# EAGLE design main_for_huzzah_wLED (EAGLE 7.3.0)
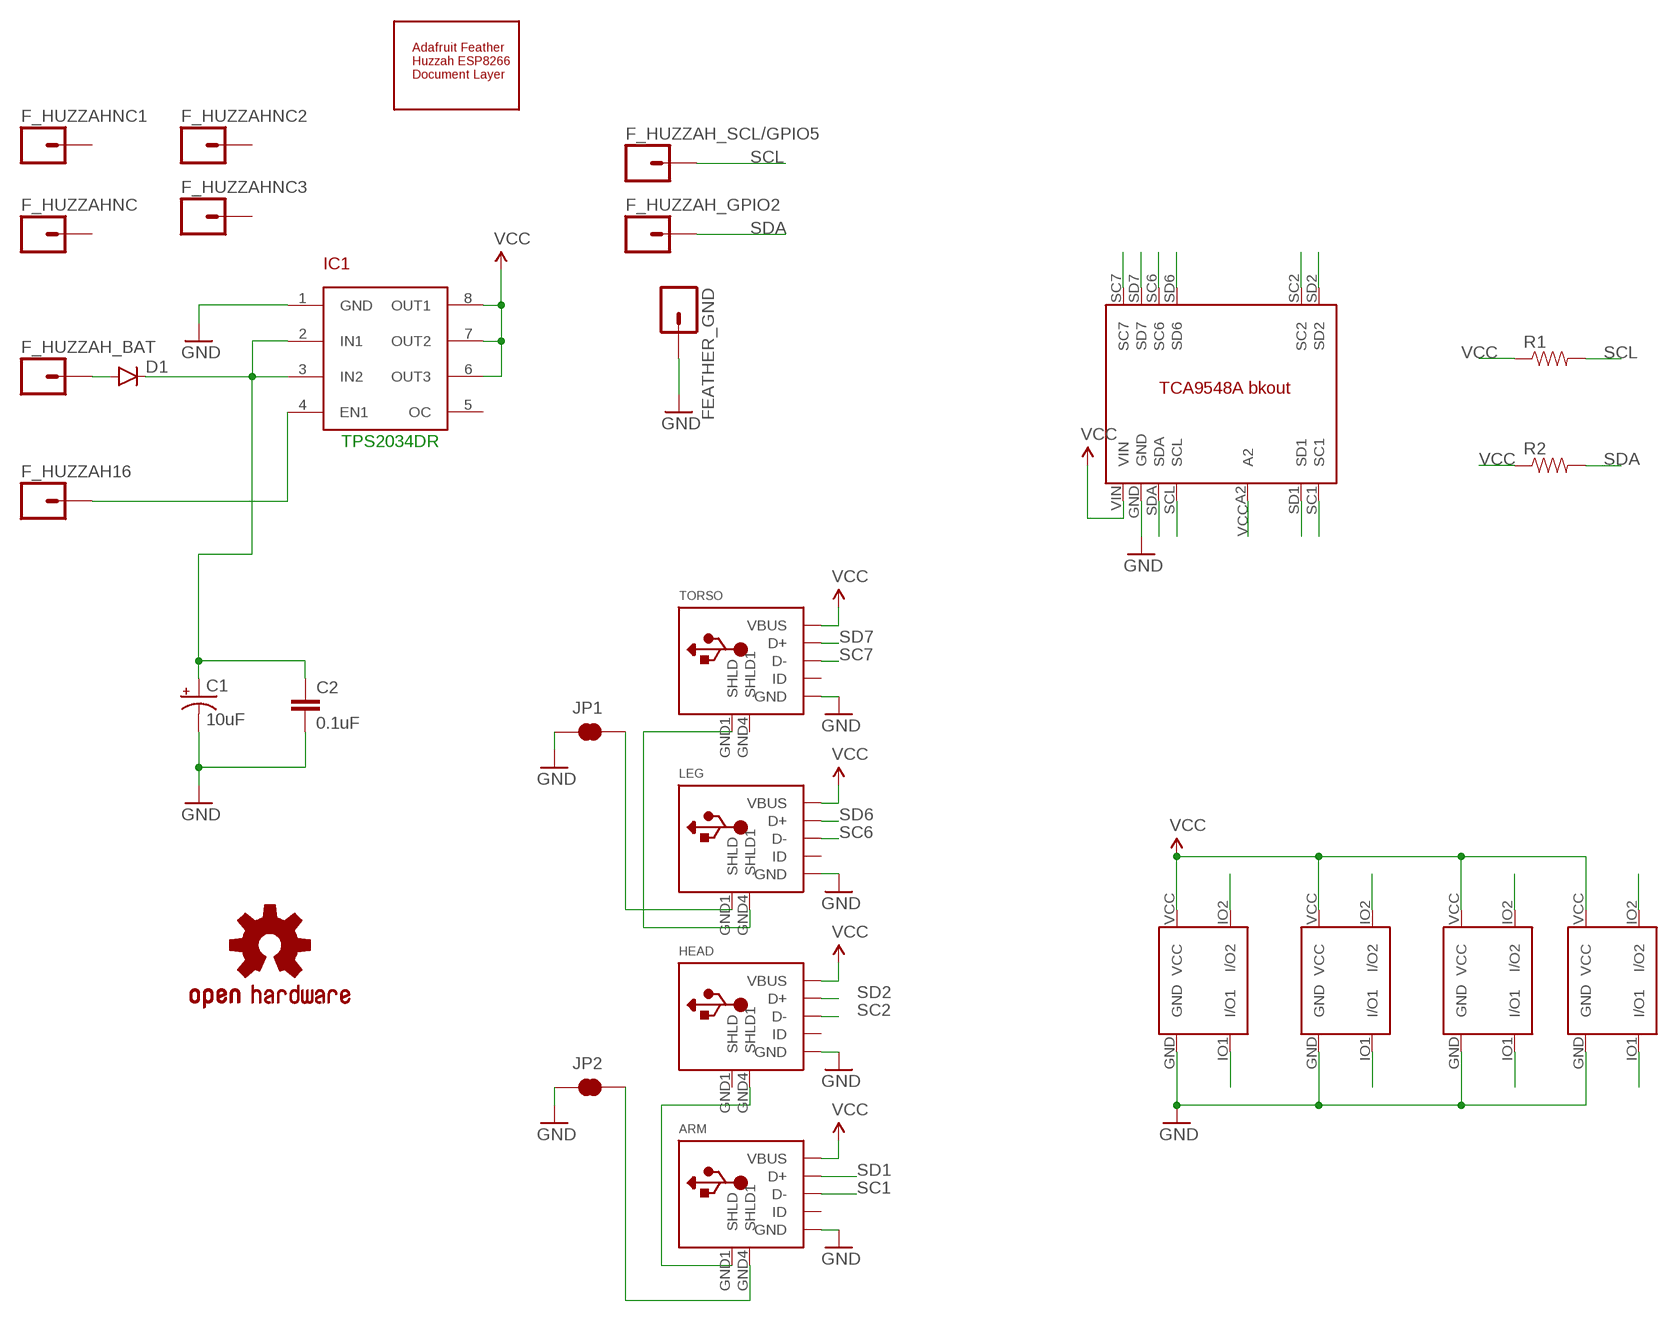
[diagram p0: schematic, sheet 1]

## Parts
ARM  USB  [USB-MINIB-THM-MOLEX_NOSLK]
C1  10uF  CAP_POLPTH2  [CPOL-RADIAL-10UF-25V]
C2  0.1uF  CAPPTH  [CAP-PTH-SMALL]
D1  DIODEKIT2  [DIODE-1N4001-KIT]
F_HUZZAH16  M01  [1X01SMALL_NS]
F_HUZZAH_BAT  M01  [1X01SMALL_NS]
F_HUZZAH_GPIO2  M01  [1X01SMALL_NS]
F_HUZZAH_SCL/GPIO5  M01  [1X01SMALL_NS]
F_HUZZAHNC  M01  [1X01SMALL_NS]
F_HUZZAHNC1  M01  [1X01SMALL_NS]
F_HUZZAHNC2  M01  [1X01SMALL_NS]
F_HUZZAHNC3  M01  [1X01SMALL_NS]
FEATHER_GND  M01  [1X01SMALL_NS]
HEAD  USB  [USB-MINIB-THM-MOLEX_NOSLK]
IC1  TPS2055A  [SO-08]
JP1  JUMPER-PAD-2-NC_BY_TRACENO_SILK  [PAD-JUMPER-2-NC_BY_TRACE_NO_SILK]
JP2  JUMPER-PAD-2-NC_BY_TRACENO_SILK  [PAD-JUMPER-2-NC_BY_TRACE_NO_SILK]
LEG  USB  [USB-MINIB-THM-MOLEX_NOSLK]
LOGO1  OSHW-LOGOM  [OSHW-LOGO-M]
R1  RESISTORAXIAL-0.3  [AXIAL-0.3]
R2  RESISTORAXIAL-0.3  [AXIAL-0.3]
TORSO  USB  [USB-MINIB-THM-MOLEX_NOSLK]
U$1  TCA9548_MIN  [TCA9548_NOEXTRA]
U$2  TVS_ARRAY_CD143A  [SOT-143]
U$3  TVS_ARRAY_CD143A  [SOT-143]
U$4  TVS_ARRAY_CD143A  [SOT-143]
U$5  TVS_ARRAY_CD143A  [SOT-143]
U$7  FEATHER_HUZZAH_DOCUMENT  [FEATHER_HUZZAH_DOC_ONLY]

## Nets
GND: ARM.GND C1.2(-) C2.2 FEATHER_GND.P$1 HEAD.GND IC1.1(GND) JP1.1 JP2.1 LEG.GND TORSO.GND U$1.GND U$2.GND U$3.GND U$4.GND U$5.GND
N$1: LEG.GND4(SHLD1) TORSO.GND1(SHLD)
N$2: JP1.2 LEG.GND1(SHLD)
N$3: ARM.GND1(SHLD) HEAD.GND4(SHLD1)
N$4: ARM.GND4(SHLD1) JP2.2
N$6: D1.A F_HUZZAH_BAT.P$1
N$7: F_HUZZAH16.P$1 IC1.4(EN1)
N$8: C1.1(+) C2.1 D1.C IC1.2(IN1) IC1.3(IN2)
SC1: ARM.D- U$1.SC1 U$3.IO1(I/O1)
SC2: HEAD.D- U$1.SC2 U$2.IO1(I/O1)
SC6: LEG.D- U$1.SC6 U$5.IO1(I/O1)
SC7: TORSO.D- U$1.SC7 U$4.IO1(I/O1)
SCL: F_HUZZAH_SCL/GPIO5.P$1 R1.P$2 U$1.SCL
SD1: ARM.D+ U$1.SD1 U$3.IO2(I/O2)
SD2: HEAD.D+ U$1.SD2 U$2.IO2(I/O2)
SD6: LEG.D+ U$1.SD6 U$5.IO2(I/O2)
SD7: TORSO.D+ U$1.SD7 U$4.IO2(I/O2)
SDA: F_HUZZAH_GPIO2.P$1 R2.P$2 U$1.SDA
VCC: ARM.VBUS HEAD.VBUS IC1.6(OUT3) IC1.7(OUT2) IC1.8(OUT1) LEG.VBUS R1.P$1 R2.P$1 TORSO.VBUS U$1.A2 U$1.VIN U$2.VCC U$3.VCC U$4.VCC U$5.VCC
Unconnected: ARM.ID F_HUZZAHNC1.P$1 F_HUZZAHNC2.P$1 F_HUZZAHNC3.P$1 F_HUZZAHNC.P$1 HEAD.GND1(SHLD) HEAD.ID IC1.5(OC) LEG.ID TORSO.GND4(SHLD1) TORSO.ID

## Notes on the sheet
- TPS2034DR

## Library data of the parts
ARM HEAD LEG TORSO = adafruit:USB: USB Connectors USBMINIB - Surface Mount Female Mini-B USB Connector 4UConnector: 06564 By microbuilder.eu Thru-hole RA Female Mini-B USB Connector 4UConnector: 18732 By ladyada.net
C1 = SparkFun-Passives:CAP_POL: Capacitor Polarized These are standard SMD and PTH capacitors. Normally 10uF, 47uF, and 100uF in electrolytic and tantalum varieties. Always verify the external diameter of the through hole cap, it varies with capacity, voltage, and manufacturer. The EIA devices should be standard.
C2 = SparkFun-Passives:CAP: Capacitor Standard 0603 ceramic capacitor, and 0.1" leaded capacitor.
D1 = SparkFun-DiscreteSemi:DIODE: Diode These are standard reverse protection diodes and small signal diodes. SMA package can handle up to about 1A. SOD-323 can handle about 200mA. What the SOD-323 package when ordering, there are some mfgs out there that are 5-pin packages.
F_HUZZAH16 F_HUZZAH_BAT F_HUZZAH_GPIO2 F_HUZZAH_SCL/GPIO5 F_HUZZAHNC F_HUZZAHNC1-F_HUZZAHNC3 FEATHER_GND = SparkFun-Connectors:M01: Header 1 Standard 1-pin 0.1" header. Use with straight break away headers (SKU : PRT-00116), right angle break away headers (PRT-00553), swiss pins (PRT-00743), machine pins (PRT-00117), and female headers (PRT-00115). SMTSO-256-ET is a "flush mount" nut for a 4-40 screw. The older package used to be too tight, and did not allow it to sit properly thru the drill hit. The latest (0.165DIA) fits nice and snug.
IC1 = skeleton:TPS2055A
JP1 JP2 = SparkFun-Passives:JUMPER-PAD-2-NC_BY_TRACE
LOGO1 = SparkFun-Aesthetics:OSHW-LOGO: Open Source Hardware Logo This logo indicates the piece of hardware it is found on incorporates a OSHW license and/or adheres to the definition of open source hardware found here: http://freedomdefined.org/OSHW
R1 R2 = SparkFun-Passives:RESISTOR: Resistor Basic schematic elements and footprints for 0603, 1206, and PTH resistors.
U$1 = skeleton:TCA9548_MIN
U$2-U$5 = skeleton:TVS_ARRAY_CD143A
U$7 = adafruit:FEATHER_HUZZAH_DOCUMENT

## Board
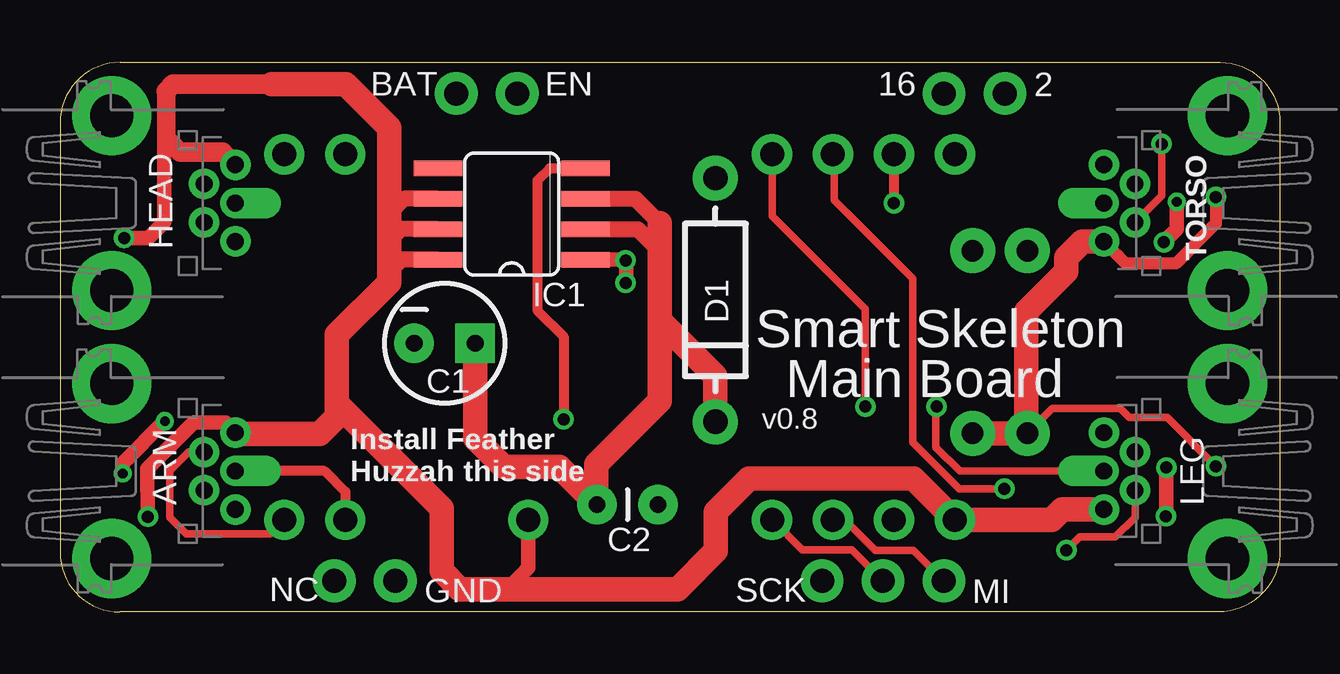
[diagram p1: board, top side]
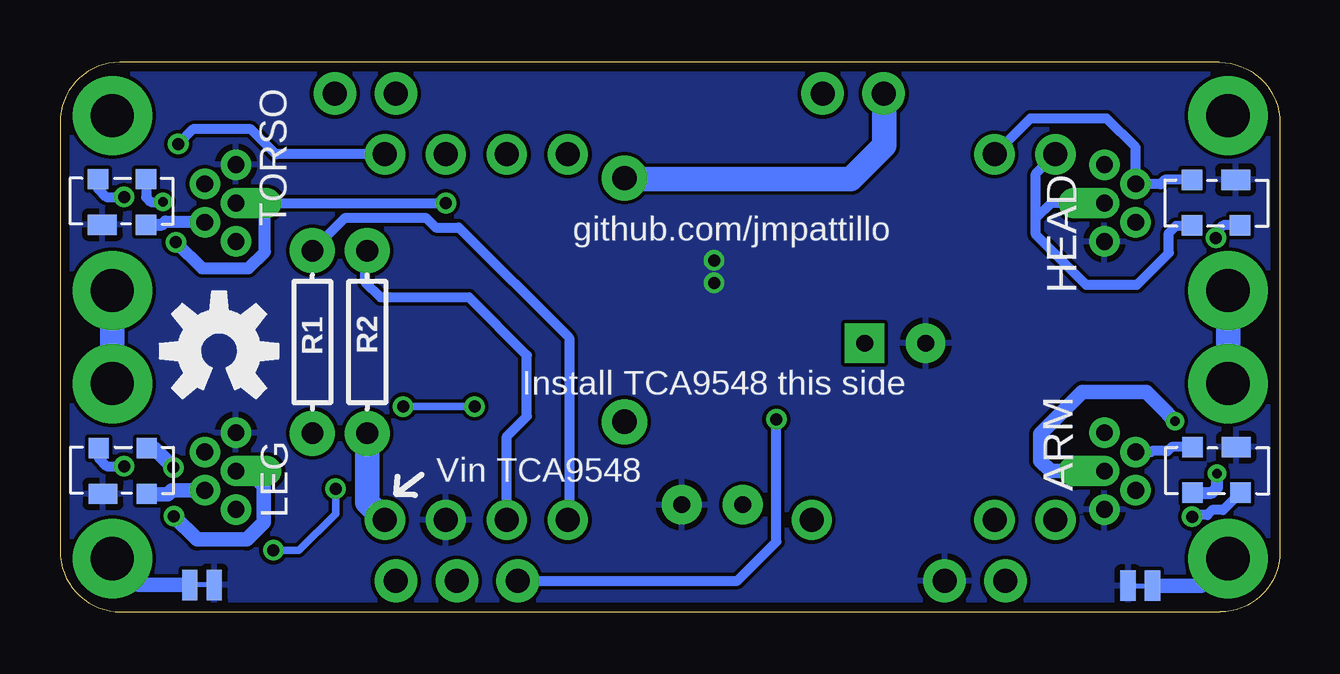
[diagram p2: board, bottom side, seen from below]

Size 50.83 x 22.91 mm. Coordinates in mm from the lower left corner, seen from the top.
Outline: 48.29,0 2.49,0 arc-90 0,2.49 0,20.4 arc-90 2.52,22.91 48.34,22.91 arc-90 50.83,20.42 50.83,2.54 arc-90 48.29,0
Copper layers (1*16): Top 0.0356mm / dielectric 1.5011mm / Bottom 0.0356mm
Design rules "LaenPCBOrder *": minimum track width 6mil, minimum drill 13mil, track to track 6mil, track to pad 6mil, pad to pad 6mil, via to via 6mil, smd to smd 6mil, copper to edge 15mil, drill to drill 6mil, minimum pad ring 7mil, minimum via ring 7mil, stop-mask expansion 3mil, vias tented up to drill 25mil, thermal gap 10mil

### Footprints (pad centres in the part's own frame; a part is rotated, then mirrored left to right if it is on the bottom)
USB-MINIB-THM-MOLEX_NOSLK = drill 0.7 pad 1.27 offset: D+ 0,9.72 | drill 0.7 pad 1.27: D- -0.8,8.42; GND 1.6,9.72; ID 0.8,8.42; VBUS -1.6,9.72 | drill 1.8 pad 3.302: GND1 -3.65,4.57; GND4 3.65,4.57
CPOL-RADIAL-10UF-25V = drill 0.7 pad 1.651 square: 1 1.27,0 | drill 0.7 pad 1.651: 2 -1.27,0
CAP-PTH-SMALL = drill 0.7 pad 1.651: 1 0,0; 2 2.54,0
DIODE-1N4001-KIT = drill 1.016 pad 1.88: A -5.08,0; C 5.08,0
1X01SMALL_NS = drill 1 pad 1.778: P$1 0,0
SO-08 = smd 0.66 x 2.032: 1 -1.905,-3.073; 2 -0.635,-3.073; 3 0.635,-3.073; 4 1.905,-3.073; 5 1.905,3.073; 6 0.635,3.073; 7 -0.635,3.073; 8 -1.905,3.073
PAD-JUMPER-2-NC_BY_TRACE_NO_SILK = smd 0.635 x 1.27: 1 -0.508,0; 2 0.508,0
AXIAL-0.3 = drill 0.9 pad 1.88: P$1 -3.81,0; P$2 3.81,0
TCA9548_NOEXTRA = drill 1 pad 1.676: A2 3.81,-7.62; GND -11.43,-7.62; SC1 13.97,-7.62; SC2 11.43,7.62; SC6 -8.89,7.62; SC7 -13.97,7.62; SCL -6.35,-7.62; SD1 11.43,-7.62; SD2 13.97,7.62; SD6 -6.35,7.62; SD7 -11.43,7.62; SDA -8.89,-7.62; VIN -13.97,-7.62
SOT-143 = smd 1.2 x 0.85: GND -0.75,-0.95 | smd 0.85 x 0.85: IO1 1.075,-0.95; IO2 1.075,0.95; VCC -0.925,0.95

### Placement (x,y rotation side)
ARM  -2.41,5.87 270 top
C1  16.03,11.2 0 top
C2  22.38,4.47 0 top
D1  27.31,13 270 top
F_HUZZAH16  31.75,1.3 0 top
F_HUZZAH_BAT  16.51,21.62 0 top
F_HUZZAH_GPIO2  36.83,1.3 0 top
F_HUZZAH_SCL/GPIO5  34.29,1.3 0 top
F_HUZZAHNC  19.05,21.62 0 top
F_HUZZAHNC1  11.43,1.3 0 top
F_HUZZAHNC2  36.83,21.62 0 top
F_HUZZAHNC3  39.37,21.62 0 top
FEATHER_GND  13.97,1.3 0 top
HEAD  -2.41,17.04 270 top
IC1  18.82,16.59 90 top
JP1  44.91,1.12 180 bottom
JP2  5.82,1.09 0 bottom
LEG  53.21,5.87 90 top
LOGO1  44.2,10.87 0 bottom
R1  40.31,11.25 90 bottom
R2  38.02,11.25 90 bottom
TORSO  53.21,17.04 90 top
U$1  23.32,11.46 0 bottom
U$2  2.59,17.07 180 bottom
U$3  2.57,5.92 180 bottom
U$4  48.31,17.09 0 bottom
U$5  48.29,5.87 0 bottom
U$7  0,0.03 0 top

### Tracks (layer width: path | path; a pad name or v marks a point on that pad's centre or on a via)
GND  (via drill 0.5)
  Top 0.61: IC1.1 23.55,14.68 v23.57,14.66 23.6,14.66 23.6,13.69
  other vias: 23.57,13.72
  pour Bottom: 0,22.89 50.8,22.89 50.8,0.03 0,0.03
N$1
  Bottom 1.016: TORSO.GND1 LEG.GND4
N$2
  Bottom 0.61: LEG.GND1 47.54,1.12 JP1.2
N$3
  Bottom 1.016: HEAD.GND4 ARM.GND1
N$4
  Bottom 0.61: ARM.GND4 3.28,1.09 JP2.2
N$6
  Bottom 1.016: D1.A 27.25,18.03 17.88,18.03 16.49,19.43 16.49,21.59 F_HUZZAH_BAT.P$1
N$7  (via drill 0.5)
  Top 0.406: IC1.4 20.4,18.49 19.89,17.98 19.89,12.57 20.98,11.48 v20.98,8.03
  Bottom 0.406: F_HUZZAH16.P$1 22.61,1.3 20.98,2.92 v20.98,8.03
N$8
  Top 0.66: IC1.3 23.98,17.22 24.99,16.21 | IC1.2 24.08,15.95 24.99,15.04
  Top 1.016: 24.99,16.21 24.99,15.04 24.99,12.14 | 24.99,12.14 24.99,8.79 22.35,6.15 22.35,4.42 C2.1 20.8,6.05 18.49,6.05 17.3,7.24 C1.1 | D1.C 27.31,9.83 24.99,12.14
SC1
  Top 0.305: U$1.SC1 8.76,3.25 5.26,3.25 4.57,3.94 4.57,5.87 5.37,6.67 ARM.D-
  Bottom 0.406: U$3.IO1 4.51,6.87 4.67,6.71 5.33,6.71 5.37,6.67 ARM.D-
SC2
  Bottom 0.406: U$2.IO1 4.79,18.02 4.98,17.83 5.99,17.83 HEAD.D- 6.01,19.37 7.21,20.57 10.39,20.57 U$1.SC2
SC6  (via drill 0.5)
  Top 0.305: LEG.D- 44.79,3.95 43.97,3.12 42.49,3.12 v41.94,2.57 | U$1.SC6 32.26,19.02 32.26,17.17 35.53,13.89 35.53,7.06 37.47,5.13 v39.34,5.13
  Bottom 0.305: v41.94,2.57 40.87,2.57 39.34,4.09 v39.34,5.13
  Bottom 0.61: LEG.D- 46.16,5.07 46.33,4.9 47.2,4.9 U$5.IO1
SC7  (via drill 0.5)
  Top 0.305: TORSO.D- 45.9,17.35 v45.9,19.51
  Bottom 0.406: U$1.SC7 41.83,19.08 42.88,20.12 45.29,20.12 v45.9,19.51
  Bottom 0.508: 47.23,16.15 46.56,16.15 46.43,16.28 44.83,16.28 TORSO.D-
  Bottom 0.61: 47.23,16.15 U$4.IO1
SCL
  Top 0.305: F_HUZZAH_SCL/GPIO5.P$1 33,2.59 30.94,2.59 29.69,3.84 U$1.SCL
  Bottom 0.406: 29.62,3.89 29.62,11.43 34.21,16.03 35.18,16.03 35.56,16.41 38.96,16.41 R1.P$2
  Bottom 0.61: 29.62,3.89 U$1.SCL
SD1  (via drill 0.4)
  Top 0.406: U$1.SD1 11.89,5 11.02,5.87 ARM.D+
  Top 0.61: v4.37,7.95 2.62,6.2 v2.62,5.77
  Bottom 0.508: U$3.IO2 2.83,4.97 2.62,5.18 v2.62,5.77
  Bottom 0.61: v4.37,7.95 4.67,8.26 4.67,8.28 5.56,9.17 8.23,9.17 9.98,7.42 9.98,6.3 9.55,5.87 ARM.D+
SD2
  Bottom 0.406: 10.16,16.41 10.16,15.72 8.08,13.64 5.94,13.64 4.62,14.96 4.62,15.8 4.32,16.1 3.68,16.1 U$2.IO2 | 10.16,16.41 10.16,18.26 U$1.SD2 | HEAD.D+ 9.53,17.04 10.16,16.41
SD6  (via drill 0.5)
  Top 0.305: LEG.D+ 37.49,5.87 36.5,6.86 36.5,8.53 v36.53,8.56 | U$1.SD6 29.67,16.51 33.55,12.62 v33.55,8.56
  Top 0.406: 43.47,5.89 LEG.D+
  Top 0.61: v46.1,6.02 46.1,4.01 v46.08,3.99
  Bottom 0.305: v33.55,8.56 v36.53,8.56
  Bottom 0.61: v46.08,3.99 45.11,3.02 43.05,3.02 42.34,3.73 42.34,5.26 42.95,5.87 LEG.D+ | U$5.IO2 46.9,6.82 v46.1,6.02
SD7  (via drill 0.4, 0.5)
  Top 0.406: U$1.SD7 v34.75,17.04
  Top 0.61: v46.53,17.09 46.53,15.95 v46,15.42
  Bottom 0.406: U$4.IO2 47.24,17.29 47.04,17.09 v46.53,17.09 | TORSO.D+ 42.29,17.04 v34.75,17.04
  Bottom 0.508: v46,15.42 44.91,14.33 42.98,14.33 42.29,15.01 42.29,17.04
SDA
  Top 0.305: F_HUZZAH_GPIO2.P$1 35.56,2.57 33.96,2.57 32.69,3.84 U$1.SDA
  Bottom 0.406: U$1.SDA 32.21,7.32 31.37,8.15 31.37,10.69 33.78,13.11 37.47,13.11 38.1,13.74 38.1,14.99 R2.P$2
VCC  (via drill 0.5)
  Top 0.305: v48.16,6.07 46.13,8.1 44.55,8.1 44.17,8.48 41.35,8.48 R1.P$1
  Top 0.508: v48.16,17.3 48.16,16.18 46.51,14.53 44.41,14.53 TORSO.VBUS 44.08,14.86 | R1.P$1 40.26,7.49 40.21,7.44
  Top 0.61: v3.66,3.96 3.63,5.97 5.56,7.9 6.88,7.9 ARM.VBUS | HEAD.VBUS 6.75,19.2 | v2.67,15.6 3.68,15.6 4.34,16.26 4.34,20.52 4.42,20.6 | 18.62,0.94 19.19,1.51 19.51,1.83 U$1.A2
  Top 0.66: IC1.6 14.33,17.22 13.72,16.61 | IC1.8 14.22,14.68 13.72,14.17 | IC1.7 14.2,15.95 13.72,15.47
  Top 0.762: 4.42,21.72 4.42,20.6 4.42,19.76 5,19.18
  Top 0.813: 5,19.18 6.77,19.18 HEAD.VBUS | 8.81,22 8.74,22 | 4.42,21.72 4.7,22 9.04,22
  Top 0.914: 16.66,0.94 16.82,0.94
  Top 1.016: ARM.VBUS 7.36,7.42 10.82,7.42 11.53,8.13 11.53,8.69 | 11.53,8.69 11.53,11.56 13.72,13.74 13.72,14.17 13.72,15.47 13.72,16.61 13.72,20.19 11.91,22 9.04,22 8.81,22 | 16.82,0.94 18.62,0.94 25.73,0.94 27.33,2.54 27.33,4.17 28.73,5.56 35.56,5.56 U$1.VIN 41.33,3.84 41.76,4.27 LEG.VBUS | LEG.VBUS | R2.P$1 R1.P$1 | 40.26,7.49 40.26,12.52 41.94,14.2 41.94,14.78 42.6,15.44 TORSO.VBUS | 16.66,0.94 15.9,1.7 15.9,4.32 11.53,8.69
  Bottom 0.406: U$5.VCC 49.21,6.41 48.87,6.07 v48.16,6.07 | U$4.VCC 49.24,17.64 48.9,17.3 v48.16,17.3 | U$3.VCC 2.37,4.24 2.82,4.24 3.02,4.04 3.58,4.04 v3.66,3.96 | U$2.VCC 2.35,16.12 2.64,15.82 v2.67,15.6
  Bottom 1.016: R2.P$1 38.02,4.57 U$1.VIN

### Text on the board
tPlace: EN | 16 | 2 | Smart Skeleton / Main Board | v0.8 | NC | GND | SCK | MI
bPlace: github.com/jmpattillo | TORSO | HEAD | Install TCA9548 this side | LEG | Vin TCA9548 | ARM
tNames: BAT | Install Feather / Huzzah this side